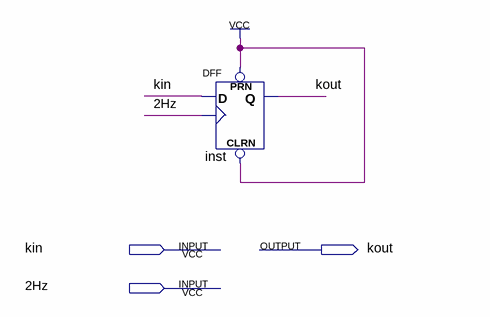
[diagram p0: schematic sheet]
// Quartus schematic xiaochan.bdf as structural Verilog: 1 symbols, 3 pins
module xiaochan (
  input  kin,
  input  \2Hz ,
  output kout
);

  DFF inst (.CLRN(1'b1), .CLK(\2Hz ), .D(kin), .PRN(1'b1), .Q(kout));
endmodule
